# EAGLE schematic qPCR_pcb_module_sense (EAGLE 9.6.1)
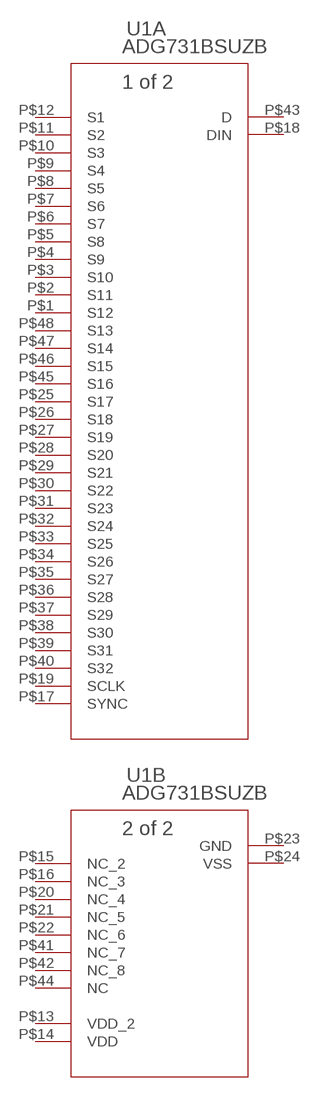
[diagram p0: schematic, sheet 1]

## Parts
U1  ADG731BSUZB  [SU_48_ADI-BREAK]
Unconnected: U1.P$1(A:S12) U1.P$2(A:S11) U1.P$3(A:S10) U1.P$4(A:S9) U1.P$5(A:S8) U1.P$6(A:S7) U1.P$7(A:S6) U1.P$8(A:S5) U1.P$9(A:S4) U1.P$10(A:S3) U1.P$11(A:S2) U1.P$12(A:S1) U1.P$15(B:NC_2) U1.P$16(B:NC_3) U1.P$17(A:SYNC) U1.P$18(A:DIN) U1.P$19(A:SCLK) U1.P$20(B:NC_4) U1.P$21(B:NC_5) U1.P$22(B:NC_6) U1.P$23(B:GND) U1.P$25(A:S17) U1.P$26(A:S18) U1.P$27(A:S19) U1.P$28(A:S20) U1.P$29(A:S21) U1.P$30(A:S22) U1.P$31(A:S23) U1.P$32(A:S24) U1.P$33(A:S25) U1.P$34(A:S26) U1.P$35(A:S27) U1.P$36(A:S28) U1.P$37(A:S29) U1.P$38(A:S30) U1.P$39(A:S31) U1.P$40(A:S32) U1.P$41(B:NC_7) U1.P$42(B:NC_8) U1.P$43(A:D) U1.P$44(B:NC) U1.P$45(A:S16) U1.P$46(A:S15) U1.P$47(A:S14) U1.P$48(A:S13)

## Power pins joined to a net without a drawn wire
VDD: U1.P$14(B:VDD)
VDD_2: U1.P$13(B:VDD_2)
VSS: U1.P$24(B:VSS)

## Library data of the parts
U1 = Ninja_qPCR:ADG731BSUZ